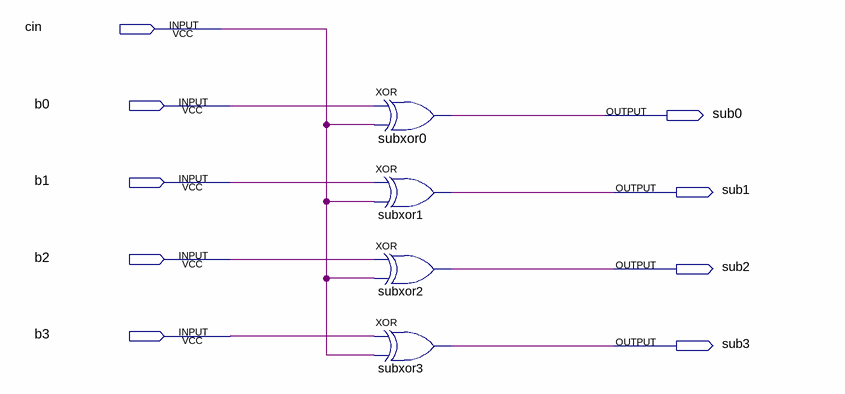
[diagram p0: schematic sheet]
// Quartus schematic subtrator.bdf as structural Verilog: 4 symbols, 9 pins
module subtrator (
  input  cin,
  input  b0,
  input  b1,
  input  b2,
  input  b3,
  output sub0,
  output sub1,
  output sub2,
  output sub3
);

  xor subxor0 (sub0, b0, cin);
  xor subxor1 (sub1, b1, cin);
  xor subxor2 (sub2, b2, cin);
  xor subxor3 (sub3, b3, cin);
endmodule
